# Altium schematic sheet ECG_Monitor.SchDoc
size A; SheetNumber: 1; SheetTotal: 1
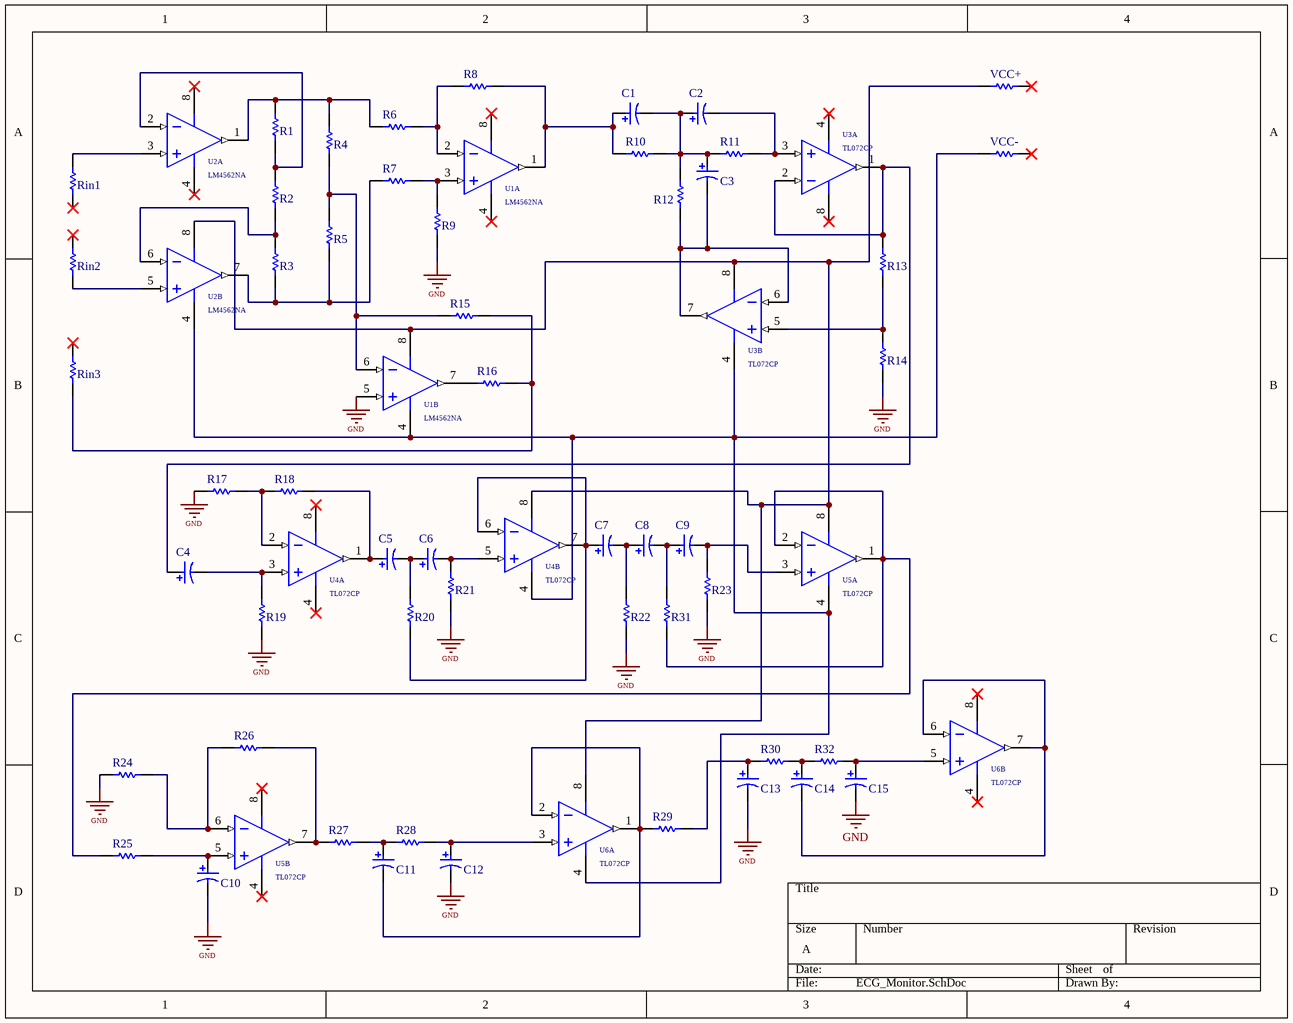
[diagram p0: ECG_Monitor.SchDoc]

## Parts
C1  ECA1HM100  [CAPPR55-200-1100X500X1200]  (value not drawn)
C2  ECA1HM100  [CAPPR55-200-1100X500X1200]  (value not drawn)
C3  ECA1HM100  [CAPPR55-200-1100X500X1200]  (value not drawn)
C4  ECA1HM100  [CAPPR55-200-1100X500X1200]  (value not drawn)
C5  ECA1HM100  [CAPPR55-200-1100X500X1200]  (value not drawn)
C6  ECA1HM100  [CAPPR55-200-1100X500X1200]  (value not drawn)
C7  ECA1HM100  [CAPPR55-200-1100X500X1200]  (value not drawn)
C8  ECA1HM100  [CAPPR55-200-1100X500X1200]  (value not drawn)
C9  ECA1HM100  [CAPPR55-200-1100X500X1200]  (value not drawn)
C10  ECA1HM100  [CAPPR55-200-1100X500X1200]  (value not drawn)
C11  ECA1HM100  [CAPPR55-200-1100X500X1200]  (value not drawn)
C12  ECA1HM100  [CAPPR55-200-1100X500X1200]  (value not drawn)
C13  ECA1HM100  [CAPPR55-200-1100X500X1200]  (value not drawn)
C14  ECA1HM100  [CAPPR55-200-1100X500X1200]  (value not drawn)
C15  ECA1HM100  [CAPPR55-200-1100X500X1200]  (value not drawn)
R1  (no value)  [RESA60-630X240]
R2  (no value)  [RESA60-630X240]
R3  (no value)  [RESA60-630X240]
R4  (no value)  [RESA60-630X240]
R5  (no value)  [RESA60-630X240]
R6  (no value)  [RESA60-630X240]
R7  (no value)  [RESA60-630X240]
R8  (no value)  [RESA60-630X240]
R9  (no value)  [RESA60-630X240]
R10  (no value)  [RESA60-630X240]
R11  (no value)  [RESA60-630X240]
R12  (no value)  [RESA60-630X240]
R13  (no value)  [RESA60-630X240]
R14  (no value)  [RESA60-630X240]
R15  (no value)  [RESA60-630X240]
R16  (no value)  [RESA60-630X240]
R17  (no value)  [RESA60-630X240]
R18  (no value)  [RESA60-630X240]
R19  (no value)  [RESA60-630X240]
R20  (no value)  [RESA60-630X240]
R21  (no value)  [RESA60-630X240]
R22  (no value)  [RESA60-630X240]
R23  (no value)  [RESA60-630X240]
R24  (no value)  [RESA60-630X240]
R25  (no value)  [RESA60-630X240]
R26  (no value)  [RESA60-630X240]
R27  (no value)  [RESA60-630X240]
R28  (no value)  [RESA60-630X240]
R29  (no value)  [RESA60-630X240]
R30  (no value)  [RESA60-630X240]
R31  (no value)  [RESA60-630X240]
R32  (no value)  [RESA60-630X240]
Rin1  (no value)  [RESA60-630X240]
Rin2  (no value)  [RESA60-630X240]
Rin3  (no value)  [RESA60-630X240]
U1  LM4562NA  [N08E]  (parts A,B of 2)
U2  LM4562NA  [N08E]  (parts A,B of 2)
U3  TL072CP  [P0008A]  (parts A,B of 2)
U4  TL072CP  [P0008A]  (parts A,B of 2)
U5  TL072CP  [P0008A]  (parts A,B of 2)
U6  TL072CP  [P0008A]  (parts A,B of 2)
VCC+  (no value)  [RESA60-630X240]
VCC-  (no value)  [RESA60-630X240]

## Nets
GND: C10.2 C12.2 C13.2 C15.2 R9.1 R14.1 R17.1 R19.1 R21.1 R22.1 R23.1 R24.1 U1.5(IN_B)
NetC1_1: C1.1 R8.2 R10.1 U1.1(OUT_A)
NetC1_2: C1.2 C2.1 C3.1 R10.2 R11.1 R12.2
NetC2_2: C2.2 R11.2 U3.3(IN1+)
NetC3_2: C3.2 R12.1 U3.6(IN2-) U3.7(OUT2)
NetC4_1: C4.1 R13.2 U3.1(OUT1) U3.2(IN1-)
NetC4_2: C4.2 R19.2 U4.3(IN1+)
NetC5_1: C5.1 R18.2 U4.1(OUT1)
NetC5_2: C5.2 C6.1 R20.2
NetC6_2: C6.2 R21.2 U4.5(IN2+)
NetC7_1: C7.1 R20.1 U4.6(IN2-) U4.7(OUT2)
NetC7_2: C7.2 C8.1 R22.2
NetC8_2: C8.2 C9.1 R31.2
NetC9_2: C9.2 R23.2 U5.3(IN1+)
NetC10_1: C10.1 R25.2 U5.5(IN2+)
NetC11_1: C11.1 R27.2 R28.1
NetC11_2: C11.2 R29.1 U6.1(OUT1) U6.2(IN1-)
NetC12_1: C12.1 R28.2 U6.3(IN1+)
NetC13_1: C13.1 R29.2 R30.1
NetC14_1: C14.1 R30.2 R32.1
NetC14_2: C14.2 U6.6(IN2-) U6.7(OUT2)
NetC15_1: C15.1 R32.2 U6.5(IN2+)
NetR1_1: R1.1 R2.2 U2.2(IN_A)
NetR1_2: R1.2 R4.2 R6.1 U2.1(OUT_A)
NetR2_1: R2.1 R3.2 U2.6(IN_B)
NetR3_1: R3.1 R5.1 R7.1 U2.7(OUT_B)
NetR4_1: R4.1 R5.2 R15.1 U1.6(IN_B)
NetR6_2: R6.2 R8.1 U1.2(IN_A)
NetR7_2: R7.2 R9.2 U1.3(IN_A)
NetR13_1: R13.1 R14.2 U3.5(IN2+)
NetR15_2: R15.2 R16.2 Rin3.1
NetR16_1: R16.1 U1.7(OUT_B)
NetR17_2: R17.2 R18.1 U4.2(IN1-)
NetR24_2: R24.2 R26.1 U5.6(IN2-)
NetR25_1: R25.1 R31.1 U5.1(OUT1) U5.2(IN1-)
NetR26_2: R26.2 R27.1 U5.7(OUT2)
NetRin1_2: Rin1.2 U2.3(IN_A)
NetRin2_1: Rin2.1 U2.5(IN_B)
NetU1_4: U1.4(V-) U2.4(V-) U3.4(VCC-) U4.4(VCC-) U5.4(VCC-) U6.4(VCC-) VCC-.1
NetU1_8: U1.8(V+) U2.8(V+) U3.8(VCC+) U4.8(VCC+) U5.8(VCC+) U6.8(VCC+) VCC+.1

Not connected (* = marked no-connect by the designer): Rin1 1*; Rin2 2*; Rin3 2*; VCC+ 2*; VCC- 2*

## Library data of the parts
C1-C15 = CMP-1665-00038-2: Aluminum Electrolytic Capacitor, 10 uF, +/- 20%, 50 V, -40 to 85 degC, 2-Pin THD, RoHS, Bulk; Manufacturer: Panasonic; Life (Hours): 2000Hour; Lead/Base Style: Straight; Dissipation Factor: 0.12%; Capacitance: 10uF; Leakage Current: 3uA; Dielectric Material: Aluminium; Lead Diameter: 0.5mm; Voltage Rating: 50V; Ripple Current: 65mA; Package Reference: CAPPR55-200-1100X500X1200; Height: 11mm; Diameter: 5mm; REACH SVHC: NoSVHC; Mount: ThroughHole; Packaging: Bulk; Manufacturer URL: http://www.panasonic.com/; Termination: Radial; Datasheet URL: https://industrial.panasonic.com/cdbs/www-data/pdf/RDF0000/ABA0000C1218.pdf; Lead Free: LeadFree; Height - Seated (Max): 0.472inch; Case/Package: Radial; Package Description: 2-Pin Radial Lead, Dia 5 mm, Height 12 mm; Tolerance: 20%; Datasheet Version: Rev. 05, 10/2016; Package Quantity: 200; Ripple Current (AC): 65mA; Min Operating Temperature: -40degC; RoHSCompliant: true; Number of Pins: 2; Max Operating Temperature: 85degC; Voltage: 50V; Lead Pitch: 2mm; Radiation Hardening: No; Voltage Rating (DC): 50V; Length: 11mm
R1-R32 Rin1-Rin3 VCC+ VCC- = CMP-1659-00072-1: Axial Resistor, 221 Ohm, +/- 1%, 250 mW, -55 to 155 degC, 2-Pin THD, RoHS, Bulk; Max Supply Voltage: 3.6 V; Min Supply Voltage: 1.95 V; Interface: I2C; Case\Package: QFN; Nominal Supply Voltage: 2.5 V; Bandwidth: 800 Hz; Max Operating Temperature: 85 degC; Height: 0.95 mm; Mount: Surface Mount; Packaging: Tape and Reel; PackageReference: MFR-25; ComponentLink1Description: Manufacturer URL; Length: 3 mm; Min Operating Temperature: -40 degC; RoHSCompliant: true; ComponentLink2Description: Datasheet; Package Quantity: 1000; Pins: 16; ComponentLink2URL: http://www.yageo.com/documents/recent/Yageo%20LR_MFR_2013.pdf; Radiation Hardening: No; ComponentLink1URL: http://www.yageo.com/; Weight: 0.001122 oz; REACH SVHC: No SVHC; DatasheetVersion: Apr-13; PackageDescription: 2-Pin Axial Lead, Dia 2.4 mm, Body Length 6.3 mm
U1 U2 = CMP-0057-00043-2: Dual High Performance, High Fidelity Audio Operational Amplifier, 8-pin MDIP; Manufacturer: National Semiconductor; PowerWise: Y; PackageTopMarking: NSUZXYTT*LM*4562NA; CompType: Audio IC; ComponentLink2Description: LM4562 Web Page; PinCount: 8; RoHS: Y; PackageReference: N08E; DatasheetVersion: Jan-2010; RevisionNote: Component URLs added; PackageVersion: revG, May-2006; Code_JEDEC: MS-001-BA; ComponentLink3URL: http://www.national.com/packaging/folders/n08e.html; ComponentLink1Description: LM4562 Datasheet; PackageDescription: MDIP, .365 x .250 x .130in, 8 Lead, .100in Pitch; ComponentLink3Description: N08E Package Page; ComponentLink1URL: http://www.national.com/ds/LM/LM4562.pdf; ComponentLink2URL: http://www.national.com/pf/LM/LM4562.html
U3-U6 = CMP-0017-00950-2: Dual Low-Noise JFET-Input General-Purpose Operational Amplifier, 7 to 36 V, 0 to 70 degC, 8-pin DIP (P8), Pb-Free (RoHS); Manufacturer: Texas Instruments; Sub Family: General Purpose Amplifier, High Supply Voltage Amplifier (>=30V); Total Supply Voltage(Max)(+5V is 5, +/-5V is 10): 36; Slew Rate(Typ)(V/us): 13; Vn at 1kHz(Typ)(nV/rtHz): 18; GBW(Typ)(MHz): 3; CMRR(Min)(dB): 70; Total Supply Voltage(Min)(+5V is 5, +/-5V is 10): 7; Vio (25C)(Max)(mV): 10; Rating: Catalog; IIB(Max)(pA): 200; Iq per channel(Max)(mA): 2.5; Number of Channels: 2; Mounting Technology: Through Hole; ComponentLink3Description: Package Specification; PartNumber: TL072CP; PackageVersion: 4040082/E, 04/2010; Eco-Plan: Pb-Free (RoHS); DatasheetVersion: SLOS080J; Offset Drift(Typ)(uV/C): 18; ComponentLink3URL: http://www.ti.com/litv/pdf/mpdi001b; PackageDescription: 8-Pin Plastic In-Line, Body 9.59 x 6.35 mm, Pitch 2.54 mm; Code_JEDEC: MS-001; ComponentLink2URL: http://www.ti.com/lit/ds/symlink/tl072.pdf; ComponentLink1Description: Manufacturer URL; ComponentLink2Description: Datasheet; ComponentLink1URL: http://www.ti.com/; PackageReference: P0008A